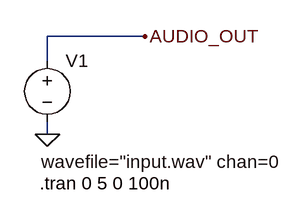
[diagram p0: schematic Audio_input.asc]
Audio_input.asc, the LTspice schematic file:
Version 4
SHEET 1 880 680
WIRE 208 112 80 112
WIRE 80 144 80 112
WIRE 80 240 80 224
FLAG 80 240 0
FLAG 208 112 AUDIO_OUT
SYMBOL voltage 80 128 R0
WINDOW 3 -8 148 Left 2
SYMATTR InstName V1
SYMATTR Value wavefile="input.wav" chan=0
TEXT 70 304 Left 2 !.tran 0 5 0 100n

The netlist it stands for:
* Audio_input.asc
V1 AUDIO_OUT 0 wavefile="input.wav" chan=0
.tran 0 5 0 100n
.backanno
.end